# Altium schematic sheet temp_sensors.SchDoc
size A
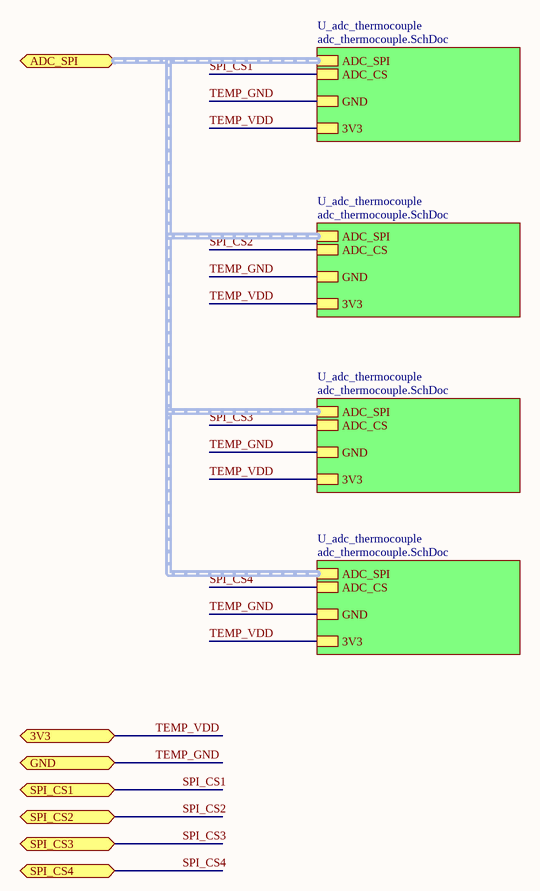
[diagram p0: temp_sensors.SchDoc]

## Sub-sheets
U_adc_thermocouple = adc_thermocouple.SchDoc: 3V3, GND, ADC_CS, ADC_SPI (harness SPI0)
U_adc_thermocouple = adc_thermocouple.SchDoc: 3V3, GND, ADC_CS, ADC_SPI (harness SPI0)
U_adc_thermocouple = adc_thermocouple.SchDoc: 3V3, GND, ADC_CS, ADC_SPI (harness SPI0)
U_adc_thermocouple = adc_thermocouple.SchDoc: 3V3, GND, ADC_CS, ADC_SPI (harness SPI0)

## Ports
3V3, ADC_SPI (harness SPI0), GND, SPI_CS1, SPI_CS2, SPI_CS3, SPI_CS4

## Nets
SPI_CS1: port SPI_CS1, sheet U_adc_thermocouple/ADC_CS
SPI_CS2: port SPI_CS2, sheet U_adc_thermocouple/ADC_CS
SPI_CS3: port SPI_CS3, sheet U_adc_thermocouple/ADC_CS
SPI_CS4: port SPI_CS4, sheet U_adc_thermocouple/ADC_CS
TEMP_GND: port GND, sheet U_adc_thermocouple/GND, sheet U_adc_thermocouple/GND, sheet U_adc_thermocouple/GND, sheet U_adc_thermocouple/GND
TEMP_VDD: port 3V3, sheet U_adc_thermocouple/3V3, sheet U_adc_thermocouple/3V3, sheet U_adc_thermocouple/3V3, sheet U_adc_thermocouple/3V3

## Buses and harness runs
harness port ADC_SPI = sheet U_adc_thermocouple/ADC_SPI